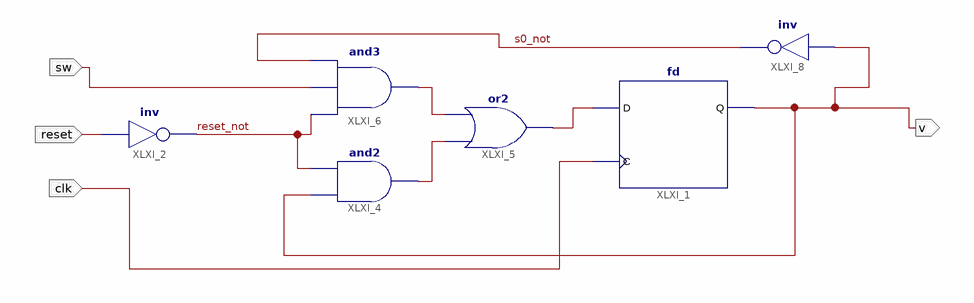
[diagram p0: schematic sheet 1]
// Xilinx ISE schematic ECE281_Celi_Lab2_sword.sch (spartan3e) as structural Verilog: 6 symbols, 4 ports
module ECE281_Celi_Lab2_sword (
  input  sw,
  input  reset,
  input  clk,
  output v
);

  wire reset_not, s0_not, XLXN_7, XLXN_8, XLXN_9;

  fd XLXI_1 (.C(clk), .D(XLXN_7), .Q(v));
  not XLXI_2 (reset_not, reset);
  and XLXI_4 (XLXN_9, v, reset_not);
  or XLXI_5 (XLXN_7, XLXN_9, XLXN_8);
  and XLXI_6 (XLXN_8, reset_not, sw, s0_not);
  not XLXI_8 (s0_not, v);
endmodule
